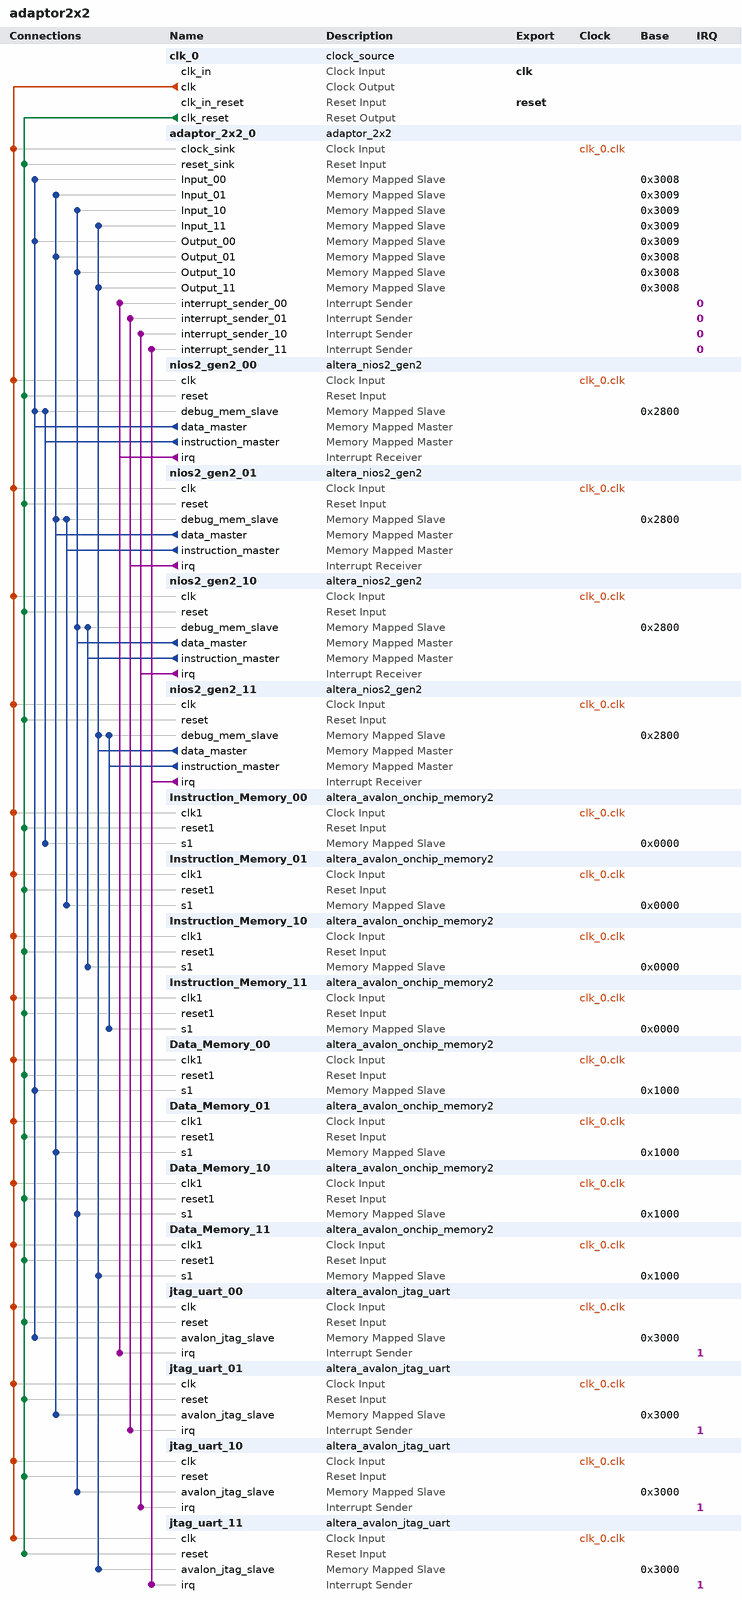
[diagram p0: system contents]
# Platform Designer (Qsys) system adaptor2x2, Cyclone V 5CSEMA4U23C6
# Parameters at their usual value, and those the tool derives, are not listed.
package require -exact qsys 17.1
create_system adaptor2x2
set_project_property DEVICE_FAMILY {Cyclone V}
set_project_property DEVICE 5CSEMA4U23C6

add_instance clk_0 clock_source 17.1
set_instance_parameter_value clk_0 clockFrequency 50000000

add_instance adaptor_2x2_0 adaptor_2x2 1.0
set_instance_parameter_value adaptor_2x2_0 DataWidth 8

add_instance nios2_gen2_00 altera_nios2_gen2 17.1
set_instance_parameter_value nios2_gen2_00 dcache_size 2048
set_instance_parameter_value nios2_gen2_00 exceptionSlave Instruction_Memory_00.s1
set_instance_parameter_value nios2_gen2_00 icache_size 4096
set_instance_parameter_value nios2_gen2_00 impl Tiny
set_instance_parameter_value nios2_gen2_00 resetSlave Instruction_Memory_00.s1

add_instance nios2_gen2_01 altera_nios2_gen2 17.1
set_instance_parameter_value nios2_gen2_01 dcache_size 2048
set_instance_parameter_value nios2_gen2_01 exceptionSlave Instruction_Memory_01.s1
set_instance_parameter_value nios2_gen2_01 icache_size 4096
set_instance_parameter_value nios2_gen2_01 impl Tiny
set_instance_parameter_value nios2_gen2_01 resetSlave Instruction_Memory_01.s1

add_instance nios2_gen2_10 altera_nios2_gen2 17.1
set_instance_parameter_value nios2_gen2_10 dcache_size 2048
set_instance_parameter_value nios2_gen2_10 exceptionSlave Instruction_Memory_10.s1
set_instance_parameter_value nios2_gen2_10 icache_size 4096
set_instance_parameter_value nios2_gen2_10 impl Tiny
set_instance_parameter_value nios2_gen2_10 resetSlave Instruction_Memory_10.s1

add_instance nios2_gen2_11 altera_nios2_gen2 17.1
set_instance_parameter_value nios2_gen2_11 dcache_size 2048
set_instance_parameter_value nios2_gen2_11 exceptionSlave Instruction_Memory_11.s1
set_instance_parameter_value nios2_gen2_11 icache_size 4096
set_instance_parameter_value nios2_gen2_11 impl Tiny
set_instance_parameter_value nios2_gen2_11 resetSlave Instruction_Memory_11.s1

add_instance Instruction_Memory_00 altera_avalon_onchip_memory2 17.1
set_instance_parameter_value Instruction_Memory_00 dataWidth 32
set_instance_parameter_value Instruction_Memory_00 dualPort false
set_instance_parameter_value Instruction_Memory_00 initMemContent true
set_instance_parameter_value Instruction_Memory_00 initializationFileName onchip_mem.hex
set_instance_parameter_value Instruction_Memory_00 memorySize 4096

add_instance Instruction_Memory_01 altera_avalon_onchip_memory2 17.1
set_instance_parameter_value Instruction_Memory_01 dataWidth 32
set_instance_parameter_value Instruction_Memory_01 dualPort false
set_instance_parameter_value Instruction_Memory_01 initMemContent true
set_instance_parameter_value Instruction_Memory_01 initializationFileName onchip_mem.hex
set_instance_parameter_value Instruction_Memory_01 memorySize 4096

add_instance Instruction_Memory_10 altera_avalon_onchip_memory2 17.1
set_instance_parameter_value Instruction_Memory_10 dataWidth 32
set_instance_parameter_value Instruction_Memory_10 dualPort false
set_instance_parameter_value Instruction_Memory_10 initMemContent true
set_instance_parameter_value Instruction_Memory_10 initializationFileName onchip_mem.hex
set_instance_parameter_value Instruction_Memory_10 memorySize 4096

add_instance Instruction_Memory_11 altera_avalon_onchip_memory2 17.1
set_instance_parameter_value Instruction_Memory_11 dataWidth 32
set_instance_parameter_value Instruction_Memory_11 dualPort false
set_instance_parameter_value Instruction_Memory_11 initMemContent true
set_instance_parameter_value Instruction_Memory_11 initializationFileName onchip_mem.hex
set_instance_parameter_value Instruction_Memory_11 memorySize 4096

add_instance Data_Memory_00 altera_avalon_onchip_memory2 17.1
set_instance_parameter_value Data_Memory_00 dataWidth 32
set_instance_parameter_value Data_Memory_00 dualPort false
set_instance_parameter_value Data_Memory_00 initMemContent true
set_instance_parameter_value Data_Memory_00 initializationFileName onchip_mem.hex
set_instance_parameter_value Data_Memory_00 memorySize 4096
set_instance_parameter_value Data_Memory_00 singleClockOperation true

add_instance Data_Memory_01 altera_avalon_onchip_memory2 17.1
set_instance_parameter_value Data_Memory_01 dataWidth 32
set_instance_parameter_value Data_Memory_01 dualPort false
set_instance_parameter_value Data_Memory_01 initMemContent true
set_instance_parameter_value Data_Memory_01 initializationFileName onchip_mem.hex
set_instance_parameter_value Data_Memory_01 memorySize 4096
set_instance_parameter_value Data_Memory_01 singleClockOperation true

add_instance Data_Memory_10 altera_avalon_onchip_memory2 17.1
set_instance_parameter_value Data_Memory_10 dataWidth 32
set_instance_parameter_value Data_Memory_10 dualPort false
set_instance_parameter_value Data_Memory_10 initMemContent true
set_instance_parameter_value Data_Memory_10 initializationFileName onchip_mem.hex
set_instance_parameter_value Data_Memory_10 memorySize 4096
set_instance_parameter_value Data_Memory_10 singleClockOperation true

add_instance Data_Memory_11 altera_avalon_onchip_memory2 17.1
set_instance_parameter_value Data_Memory_11 dataWidth 32
set_instance_parameter_value Data_Memory_11 dualPort false
set_instance_parameter_value Data_Memory_11 initMemContent true
set_instance_parameter_value Data_Memory_11 initializationFileName onchip_mem.hex
set_instance_parameter_value Data_Memory_11 memorySize 4096
set_instance_parameter_value Data_Memory_11 singleClockOperation true

add_instance jtag_uart_00 altera_avalon_jtag_uart 17.1
set_instance_parameter_value jtag_uart_00 simInteractiveOptions NO_INTERACTIVE_WINDOWS

add_instance jtag_uart_01 altera_avalon_jtag_uart 17.1
set_instance_parameter_value jtag_uart_01 simInteractiveOptions NO_INTERACTIVE_WINDOWS

add_instance jtag_uart_10 altera_avalon_jtag_uart 17.1
set_instance_parameter_value jtag_uart_10 simInteractiveOptions NO_INTERACTIVE_WINDOWS

add_instance jtag_uart_11 altera_avalon_jtag_uart 17.1
set_instance_parameter_value jtag_uart_11 simInteractiveOptions NO_INTERACTIVE_WINDOWS

# connections
add_connection clk_0.clk adaptor_2x2_0.clock_sink clock
add_connection clk_0.clk Data_Memory_00.clk1 clock
add_connection clk_0.clk Data_Memory_01.clk1 clock
add_connection clk_0.clk Data_Memory_10.clk1 clock
add_connection clk_0.clk Data_Memory_11.clk1 clock
add_connection clk_0.clk Instruction_Memory_00.clk1 clock
add_connection clk_0.clk Instruction_Memory_01.clk1 clock
add_connection clk_0.clk Instruction_Memory_10.clk1 clock
add_connection clk_0.clk Instruction_Memory_11.clk1 clock
add_connection clk_0.clk jtag_uart_00.clk clock
add_connection clk_0.clk jtag_uart_01.clk clock
add_connection clk_0.clk jtag_uart_10.clk clock
add_connection clk_0.clk jtag_uart_11.clk clock
add_connection clk_0.clk nios2_gen2_00.clk clock
add_connection clk_0.clk nios2_gen2_01.clk clock
add_connection clk_0.clk nios2_gen2_10.clk clock
add_connection clk_0.clk nios2_gen2_11.clk clock
add_connection clk_0.clk_reset adaptor_2x2_0.reset_sink reset
add_connection clk_0.clk_reset Data_Memory_00.reset1 reset
add_connection clk_0.clk_reset Data_Memory_01.reset1 reset
add_connection clk_0.clk_reset Data_Memory_10.reset1 reset
add_connection clk_0.clk_reset Data_Memory_11.reset1 reset
add_connection clk_0.clk_reset Instruction_Memory_00.reset1 reset
add_connection clk_0.clk_reset Instruction_Memory_01.reset1 reset
add_connection clk_0.clk_reset Instruction_Memory_10.reset1 reset
add_connection clk_0.clk_reset Instruction_Memory_11.reset1 reset
add_connection clk_0.clk_reset jtag_uart_00.reset reset
add_connection clk_0.clk_reset jtag_uart_01.reset reset
add_connection clk_0.clk_reset jtag_uart_10.reset reset
add_connection clk_0.clk_reset jtag_uart_11.reset reset
add_connection clk_0.clk_reset nios2_gen2_00.reset reset
add_connection clk_0.clk_reset nios2_gen2_01.reset reset
add_connection clk_0.clk_reset nios2_gen2_10.reset reset
add_connection clk_0.clk_reset nios2_gen2_11.reset reset
add_connection nios2_gen2_00.data_master adaptor_2x2_0.Input_00 avalon
set_connection_parameter_value nios2_gen2_00.data_master/adaptor_2x2_0.Input_00 baseAddress 0x3008
add_connection nios2_gen2_00.data_master adaptor_2x2_0.Output_00 avalon
set_connection_parameter_value nios2_gen2_00.data_master/adaptor_2x2_0.Output_00 baseAddress 0x3009
add_connection nios2_gen2_00.data_master Data_Memory_00.s1 avalon
set_connection_parameter_value nios2_gen2_00.data_master/Data_Memory_00.s1 baseAddress 0x1000
add_connection nios2_gen2_00.data_master jtag_uart_00.avalon_jtag_slave avalon
set_connection_parameter_value nios2_gen2_00.data_master/jtag_uart_00.avalon_jtag_slave baseAddress 0x3000
add_connection nios2_gen2_00.data_master nios2_gen2_00.debug_mem_slave avalon
set_connection_parameter_value nios2_gen2_00.data_master/nios2_gen2_00.debug_mem_slave baseAddress 0x2800
add_connection nios2_gen2_00.instruction_master Instruction_Memory_00.s1 avalon
set_connection_parameter_value nios2_gen2_00.instruction_master/Instruction_Memory_00.s1 baseAddress 0x0000
add_connection nios2_gen2_00.instruction_master nios2_gen2_00.debug_mem_slave avalon
set_connection_parameter_value nios2_gen2_00.instruction_master/nios2_gen2_00.debug_mem_slave baseAddress 0x2800
add_connection nios2_gen2_01.data_master adaptor_2x2_0.Input_01 avalon
set_connection_parameter_value nios2_gen2_01.data_master/adaptor_2x2_0.Input_01 baseAddress 0x3009
add_connection nios2_gen2_01.data_master adaptor_2x2_0.Output_01 avalon
set_connection_parameter_value nios2_gen2_01.data_master/adaptor_2x2_0.Output_01 baseAddress 0x3008
add_connection nios2_gen2_01.data_master Data_Memory_01.s1 avalon
set_connection_parameter_value nios2_gen2_01.data_master/Data_Memory_01.s1 baseAddress 0x1000
add_connection nios2_gen2_01.data_master jtag_uart_01.avalon_jtag_slave avalon
set_connection_parameter_value nios2_gen2_01.data_master/jtag_uart_01.avalon_jtag_slave baseAddress 0x3000
add_connection nios2_gen2_01.data_master nios2_gen2_01.debug_mem_slave avalon
set_connection_parameter_value nios2_gen2_01.data_master/nios2_gen2_01.debug_mem_slave baseAddress 0x2800
add_connection nios2_gen2_01.instruction_master Instruction_Memory_01.s1 avalon
set_connection_parameter_value nios2_gen2_01.instruction_master/Instruction_Memory_01.s1 baseAddress 0x0000
add_connection nios2_gen2_01.instruction_master nios2_gen2_01.debug_mem_slave avalon
set_connection_parameter_value nios2_gen2_01.instruction_master/nios2_gen2_01.debug_mem_slave baseAddress 0x2800
add_connection nios2_gen2_10.data_master adaptor_2x2_0.Input_10 avalon
set_connection_parameter_value nios2_gen2_10.data_master/adaptor_2x2_0.Input_10 baseAddress 0x3009
add_connection nios2_gen2_10.data_master adaptor_2x2_0.Output_10 avalon
set_connection_parameter_value nios2_gen2_10.data_master/adaptor_2x2_0.Output_10 baseAddress 0x3008
add_connection nios2_gen2_10.data_master Data_Memory_10.s1 avalon
set_connection_parameter_value nios2_gen2_10.data_master/Data_Memory_10.s1 baseAddress 0x1000
add_connection nios2_gen2_10.data_master jtag_uart_10.avalon_jtag_slave avalon
set_connection_parameter_value nios2_gen2_10.data_master/jtag_uart_10.avalon_jtag_slave baseAddress 0x3000
add_connection nios2_gen2_10.data_master nios2_gen2_10.debug_mem_slave avalon
set_connection_parameter_value nios2_gen2_10.data_master/nios2_gen2_10.debug_mem_slave baseAddress 0x2800
add_connection nios2_gen2_10.instruction_master Instruction_Memory_10.s1 avalon
set_connection_parameter_value nios2_gen2_10.instruction_master/Instruction_Memory_10.s1 baseAddress 0x0000
add_connection nios2_gen2_10.instruction_master nios2_gen2_10.debug_mem_slave avalon
set_connection_parameter_value nios2_gen2_10.instruction_master/nios2_gen2_10.debug_mem_slave baseAddress 0x2800
add_connection nios2_gen2_11.data_master adaptor_2x2_0.Input_11 avalon
set_connection_parameter_value nios2_gen2_11.data_master/adaptor_2x2_0.Input_11 baseAddress 0x3009
add_connection nios2_gen2_11.data_master adaptor_2x2_0.Output_11 avalon
set_connection_parameter_value nios2_gen2_11.data_master/adaptor_2x2_0.Output_11 baseAddress 0x3008
add_connection nios2_gen2_11.data_master Data_Memory_11.s1 avalon
set_connection_parameter_value nios2_gen2_11.data_master/Data_Memory_11.s1 baseAddress 0x1000
add_connection nios2_gen2_11.data_master jtag_uart_11.avalon_jtag_slave avalon
set_connection_parameter_value nios2_gen2_11.data_master/jtag_uart_11.avalon_jtag_slave baseAddress 0x3000
add_connection nios2_gen2_11.data_master nios2_gen2_11.debug_mem_slave avalon
set_connection_parameter_value nios2_gen2_11.data_master/nios2_gen2_11.debug_mem_slave baseAddress 0x2800
add_connection nios2_gen2_11.instruction_master Instruction_Memory_11.s1 avalon
set_connection_parameter_value nios2_gen2_11.instruction_master/Instruction_Memory_11.s1 baseAddress 0x0000
add_connection nios2_gen2_11.instruction_master nios2_gen2_11.debug_mem_slave avalon
set_connection_parameter_value nios2_gen2_11.instruction_master/nios2_gen2_11.debug_mem_slave baseAddress 0x2800
add_connection nios2_gen2_00.irq adaptor_2x2_0.interrupt_sender_00 interrupt
set_connection_parameter_value nios2_gen2_00.irq/adaptor_2x2_0.interrupt_sender_00 irqNumber 0
add_connection nios2_gen2_00.irq jtag_uart_00.irq interrupt
set_connection_parameter_value nios2_gen2_00.irq/jtag_uart_00.irq irqNumber 1
add_connection nios2_gen2_01.irq adaptor_2x2_0.interrupt_sender_01 interrupt
set_connection_parameter_value nios2_gen2_01.irq/adaptor_2x2_0.interrupt_sender_01 irqNumber 0
add_connection nios2_gen2_01.irq jtag_uart_01.irq interrupt
set_connection_parameter_value nios2_gen2_01.irq/jtag_uart_01.irq irqNumber 1
add_connection nios2_gen2_10.irq adaptor_2x2_0.interrupt_sender_10 interrupt
set_connection_parameter_value nios2_gen2_10.irq/adaptor_2x2_0.interrupt_sender_10 irqNumber 0
add_connection nios2_gen2_10.irq jtag_uart_10.irq interrupt
set_connection_parameter_value nios2_gen2_10.irq/jtag_uart_10.irq irqNumber 1
add_connection nios2_gen2_11.irq adaptor_2x2_0.interrupt_sender_11 interrupt
set_connection_parameter_value nios2_gen2_11.irq/adaptor_2x2_0.interrupt_sender_11 irqNumber 0
add_connection nios2_gen2_11.irq jtag_uart_11.irq interrupt
set_connection_parameter_value nios2_gen2_11.irq/jtag_uart_11.irq irqNumber 1

# exported interfaces
add_interface clk clock sink
set_interface_property clk EXPORT_OF clk_0.clk_in
add_interface reset reset sink
set_interface_property reset EXPORT_OF clk_0.clk_in_reset

set_interconnect_requirement {$system} qsys_mm.clockCrossingAdapter HANDSHAKE
set_interconnect_requirement {$system} qsys_mm.enableEccProtection FALSE
set_interconnect_requirement {$system} qsys_mm.insertDefaultSlave FALSE
set_interconnect_requirement {$system} qsys_mm.maxAdditionalLatency 1

save_system adaptor2x2.qsys
